# EAGLE design CVMot2RaspiBot (EAGLE 9.6.2)
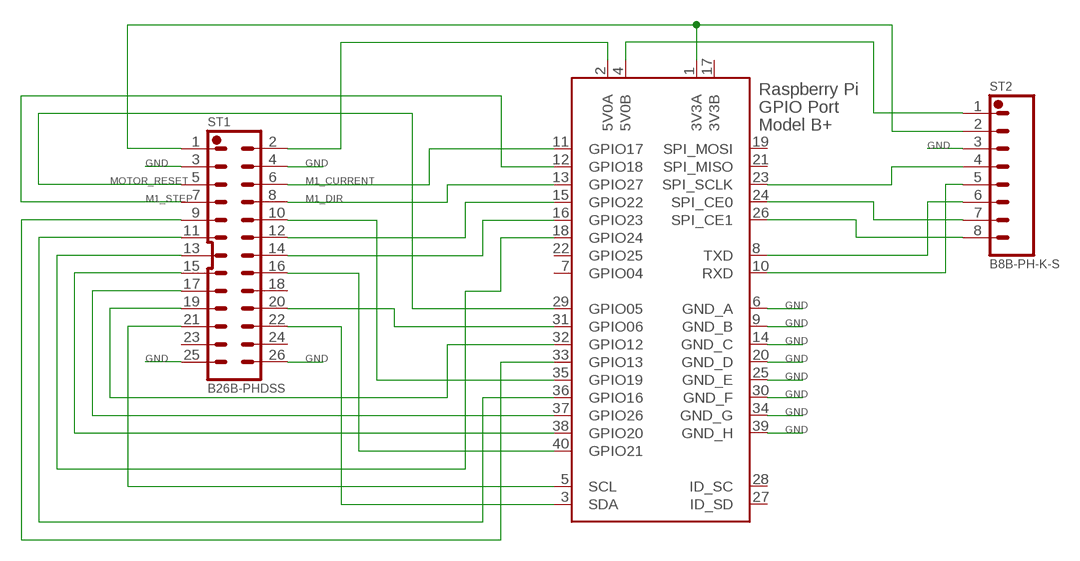
[diagram p0: schematic, sheet 1]

## Parts
ST1  B26B-PHDSS  STK-26-2RJST-PHD_26_TH  [JST-PHD_26_TH]
ST2  B8B-PH-K-S  STK-08-1RJST-PH_8_TH  [JST-PH_8_TH]
X1  RASPI_GPIO_B+#_PIN  [RASPI_GPIO_B+_PIN]

## Nets
GND: ST1.3 ST1.4 ST1.25 ST1.26 ST2.3 X1.6(GND_A) X1.9(GND_B) X1.14(GND_C) X1.20(GND_D) X1.25(GND_E) X1.30(GND_F) X1.34(GND_G) X1.39(GND_H)
M1_CURRENT: ST1.6 X1.11(GPIO17)
M1_DIR: ST1.8 X1.13(GPIO27)
M1_STEP: ST1.7 X1.12(GPIO18)
MOTOR_RESET: ST1.5 X1.29(GPIO05)
N$1: ST1.9 X1.33(GPIO13)
N$2: ST1.11 X1.36(GPIO16)
N$3: ST1.10 X1.35(GPIO19)
N$4: ST1.12 X1.15(GPIO22)
N$5: ST1.14 X1.16(GPIO23)
N$6: ST1.13 X1.18(GPIO24)
N$7: ST1.15 X1.38(GPIO20)
N$8: ST1.17 X1.37(GPIO26)
N$9: ST1.16 X1.40(GPIO21)
N$10: ST1.19 X1.32(GPIO12)
N$11: ST1.20 X1.31(GPIO06)
N$19: ST2.4 X1.23(SPI_SCLK)
N$20: ST1.2 X1.2(5V0A)
N$21: ST1.1 ST2.2 X1.1(3V3A)
N$22: ST1.21 X1.5(SCL)
N$23: ST1.22 X1.3(SDA)
N$24: ST2.1 X1.4(5V0B)
N$27: ST2.5 X1.10(RXD)
N$28: ST2.6 X1.8(TXD)
N$29: ST2.7 X1.24(SPI_CE0)
N$30: ST2.8 X1.26(SPI_CE1)
Unconnected: ST1.18 ST1.23 ST1.24 X1.7(GPIO04) X1.19(SPI_MOSI) X1.21(SPI_MISO) X1.22(GPIO25) X1.27(ID_SD) X1.28(ID_SC)

## Power pins joined to a net without a drawn wire
3V3B: X1.17(3V3B)

## Library data of the parts
ST1 = CV_Con:STK-26-2R
ST2 = CV_Con:STK-08-1R
X1 = raspberrypi_bastelstube_v13:RASPI_GPIO_B+#: 2x20 header connector, all pins connected

## Board
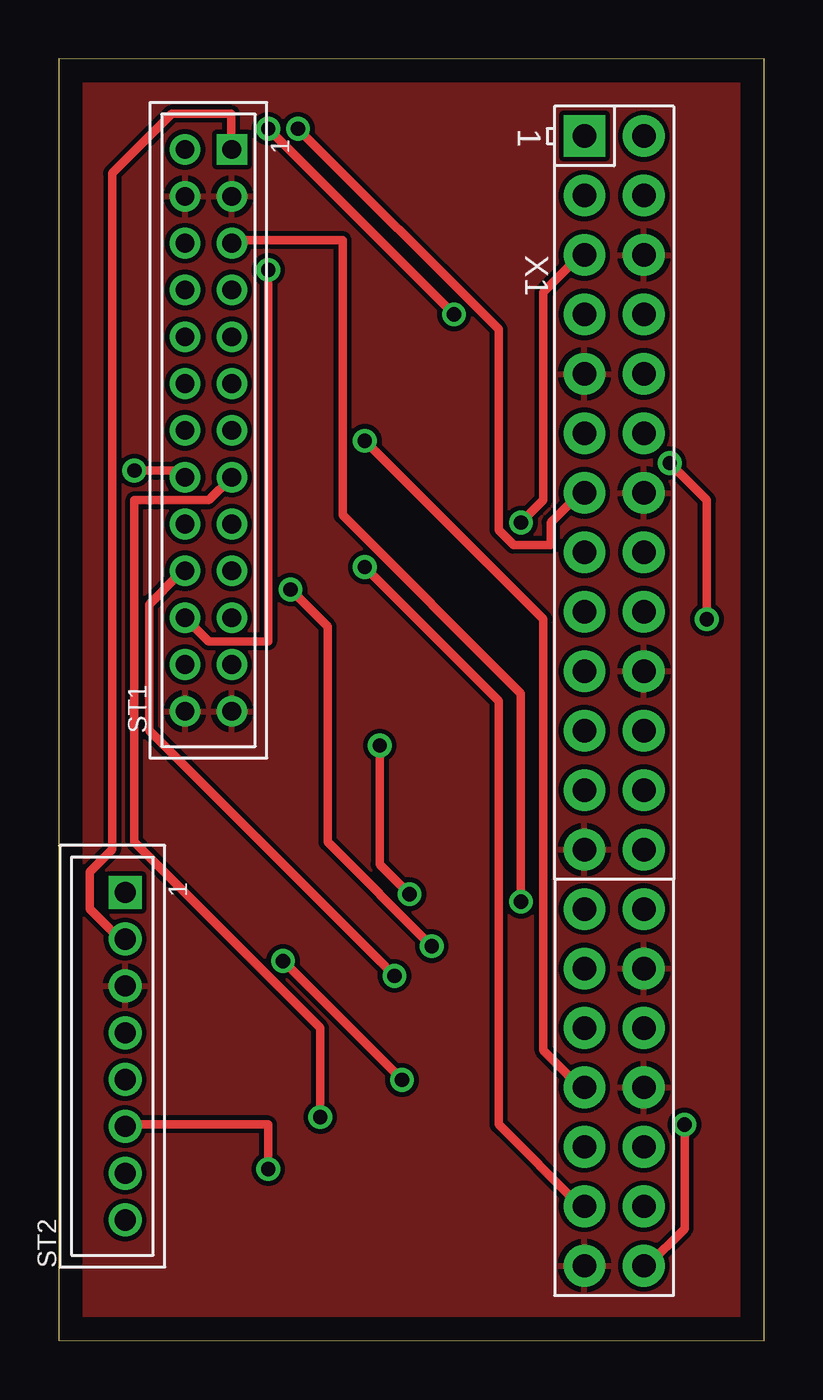
[diagram p1: board, top side]
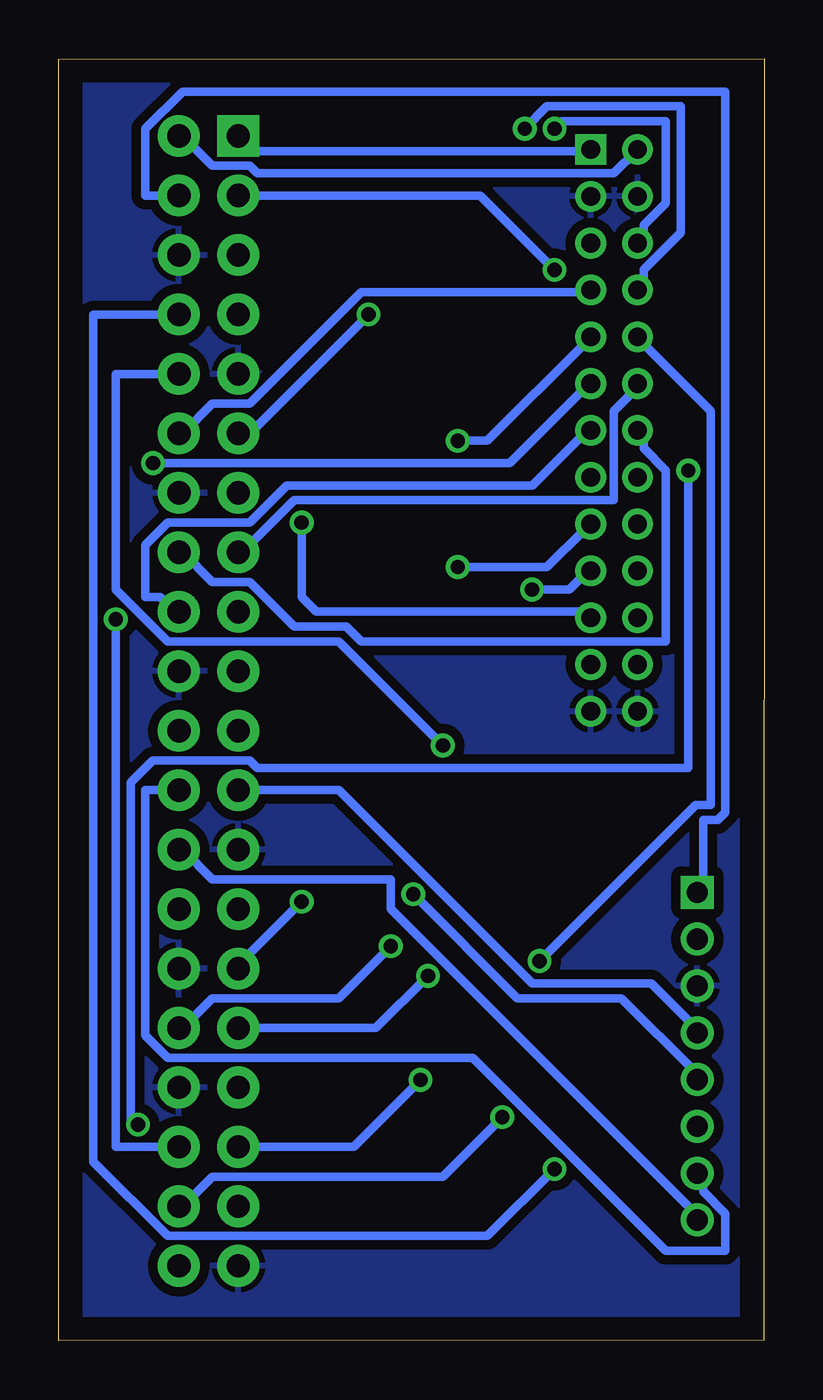
[diagram p2: board, bottom side, seen from below]

Size 30.13 x 54.79 mm. Coordinates in mm from the lower left corner, seen from the top.
Outline: 0.01,0.03 30.13,0 30.13,54.76 0,54.79 0.01,0.03
Copper layers (1*16): Top 0.035mm / dielectric 1.5mm / Bottom 0.035mm
Design rules "default *": minimum track width 14mil, minimum drill 24mil, track to track 8mil, track to pad 5mil, pad to pad 8mil, via to via 8mil, smd to smd 8mil, copper to edge 40mil, drill to drill 8mil, minimum pad ring 10mil, minimum via ring 8mil, stop-mask expansion 4mil, vias tented up to drill 0mil, thermal gap 10mil

### Footprints (pad centres in the part's own frame; a part is rotated, then mirrored left to right if it is on the bottom)
JST-PHD_26_TH = drill 0.8 square: 1 12,-1 | drill 0.8: 2 12,1; 3 10,-1; 4 10,1; 5 8,-1; 6 8,1; 7 6,-1; 8 6,1; 9 4,-1; 10 4,1; 11 2,-1; 12 2,1; 13 0,-1; 14 0,1; 15 -2,-1; 16 -2,1; 17 -4,-1; 18 -4,1; 19 -6,-1; 20 -6,1; 21 -8,-1; 22 -8,1; 23 -10,-1; 24 -10,1; 25 -12,-1; 26 -12,1
JST-PH_8_TH = drill 0.9 square: 1 7,0 | drill 0.9: 2 5,0; 3 3,0; 4 1,0; 5 -1,0; 6 -3,0; 7 -5,0; 8 -7,0
RASPI_GPIO_B+_PIN = drill 1 pad 1.778 square: 1 -24.13,-1.27 | drill 1 pad 1.778: 2 -24.13,1.27; 3 -21.59,-1.27; 4 -21.59,1.27; 5 -19.05,-1.27; 6 -19.05,1.27; 7 -16.51,-1.27; 8 -16.51,1.27; 9 -13.97,-1.27; 10 -13.97,1.27; 11 -11.43,-1.27; 12 -11.43,1.27; 13 -8.89,-1.27; 14 -8.89,1.27; 15 -6.35,-1.27; 16 -6.35,1.27; 17 -3.81,-1.27; 18 -3.81,1.27; 19 -1.27,-1.27; 20 -1.27,1.27; 21 1.27,-1.27; 22 1.27,1.27; 23 3.81,-1.27; 24 3.81,1.27; 25 6.35,-1.27; 26 6.35,1.27; 27 8.89,-1.27; 28 8.89,1.27; 29 11.43,-1.27; 30 11.43,1.27; 31 13.97,-1.27; 32 13.97,1.27; 33 16.51,-1.27; 34 16.51,1.27; 35 19.05,-1.27; 36 19.05,1.27; 37 21.59,-1.27; 38 21.59,1.27; 39 24.13,-1.27; 40 24.13,1.27

### Placement (x,y rotation side)
ST1  6.4,38.9 90 top
ST2  2.84,12.17 90 top
X1  23.72,27.34 270 top

### Tracks (layer width: path | path; a pad name or v marks a point on that pad's centre or on a via)
GND
  pour Top: -0.05,54.74 30.05,54.74 30.23,54.56 30.23,0.04 30.18,-0.01 -0.05,-0.01 0.01,0.05 0.01,54.64 0.06,54.69
  pour Bottom (isolate 0.406): 0.01,54.74 30.06,54.74 30.11,54.69 30.11,0.05 30.05,-0.01 0.25,-0.01 0.01,-0.25 0.01,54.64 0.06,54.69
M1_CURRENT  (via drill 0.61)
  Top 0.356: v16.89,43.85 v8.95,51.79
  Bottom 0.356: v8.95,51.79 8.64,52.11 4.19,52.11 4.19,48.62 5.14,47.66 5.14,47.03 ST1.6 | v16.89,43.85 21.97,38.77 X1.11
M1_DIR  (via drill 0.61)
  Top 0.356: v10.22,51.79 18.8,43.22 18.8,34.65 19.43,34.01 21.02,34.01 21.02,34.96 22.29,36.23 X1.13
  Bottom 0.356: v10.22,51.79 9.27,52.74 3.56,52.74 3.56,47.35 5.14,45.76 5.14,45.12 ST1.8
M1_STEP
  Bottom 0.356: ST1.7 7.68,44.81 17.21,44.81 21.97,40.04 23.56,40.04 24.83,38.77 X1.12
MOTOR_RESET  (via drill 0.61)
  Top 0.356: v19.75,18.77 19.75,27.66 12.13,35.28 12.13,47.03 7.68,47.03 ST1.5
  Bottom 0.356: v19.75,18.77 22.61,15.91 X1.29
N$1  (via drill 0.61)
  Top 0.356: v13.08,38.46 20.7,30.84 20.7,12.42 22.29,10.83 X1.33
  Bottom 0.356: v13.08,38.46 11.81,38.46 7.68,42.58 ST1.9
N$2  (via drill 0.61)
  Top 0.356: v26.1,37.5 27.69,35.92 v27.69,30.84
  Bottom 0.356: v26.1,37.5 10.86,37.5 7.68,40.68 ST1.11 | v27.69,30.84 27.69,8.29 X1.36
N$3  (via drill 0.61)
  Top 0.356: v14.67,11.15 v9.59,16.23
  Bottom 0.356: v9.59,16.23 2.92,22.9 2.29,22.9 2.29,39.73 5.14,42.58 ST1.10 | v14.67,11.15 17.53,8.29 X1.35
N$4
  Bottom 0.356: ST1.12 5.46,40.68 6.41,39.73 6.41,35.92 20.07,35.92 22.29,33.69 X1.15
N$5
  Bottom 0.356: ST1.14 5.14,38.77 5.14,38.14 4.19,37.19 4.19,29.88 17.21,29.88 17.84,30.52 20.07,30.52 21.97,32.42 23.56,32.42 24.83,33.69 X1.16
N$6
  Bottom 0.356: ST1.13 7.68,38.77 9.91,36.55 20.38,36.55 21.97,34.96 25.46,34.96 26.42,34.01 26.42,31.79 25.78,31.79 25.15,31.15 X1.18
N$7  (via drill 0.61)
  Top 0.356: v11.18,9.56 11.18,13.37 3.24,21.31 3.24,35.92 6.41,35.92 7.37,36.87 ST1.15
  Bottom 0.356: v11.18,9.56 13.72,7.02 23.56,7.02 24.83,5.75 X1.38
N$8  (via drill 0.61)
  Top 0.356: v13.08,33.06 18.8,27.34 18.8,9.25 22.29,5.75 X1.37
  Bottom 0.356: v13.08,33.06 9.27,33.06 7.68,34.65 ST1.17
N$9  (via drill 0.61)
  Top 0.356: v3.24,37.19 5.14,37.19 ST1.16 | v26.73,9.25 26.73,4.8 25.15,3.21 X1.40
  Bottom 0.356: v3.24,37.19 3.24,24.49 21.65,24.49 21.97,24.8 26.1,24.8 27.05,23.85 27.05,9.25 v26.73,9.25
N$10  (via drill 0.61)
  Top 0.356: v9.91,32.11 11.49,30.52 11.49,21.31 v15.94,16.87
  Bottom 0.356: v9.91,32.11 8.32,32.11 7.68,32.74 ST1.19 | v15.94,16.87 18.16,14.64 23.56,14.64 24.83,13.37 X1.32
N$11  (via drill 0.61)
  Top 0.356: v14.35,15.6 3.87,26.07 3.87,31.47 5.14,32.74 ST1.20
  Bottom 0.356: v14.35,15.6 16.57,13.37 X1.31
N$19
  Bottom 0.356: X1.23 18.16,23.53 9.91,15.28 4.83,15.28 2.92,13.37 ST2.4
N$20
  Bottom 0.356: ST1.2 5.46,50.84 6.41,49.89 21.65,49.89 21.97,50.2 23.56,50.2 24.83,51.47 X1.2
N$21
  Top 0.356: ST2.2 2.6,17.18 1.33,18.45 1.33,20.04 2.29,20.99 2.29,49.89 4.83,52.43 7.37,52.43 7.37,51.16 ST1.1
  Bottom 0.356: ST1.1 7.68,50.84 21.65,50.84 22.29,51.47 X1.1
N$22  (via drill 0.61)
  Top 0.356: v19.75,34.96 20.7,35.92 20.7,44.81 22.29,46.39 X1.5
  Bottom 0.356: v19.75,34.96 19.75,31.79 19.11,31.15 7.68,31.15 ST1.21
N$23  (via drill 0.61)
  Top 0.356: v8.95,45.76 8.95,29.88 6.41,29.88 5.46,30.84 ST1.22
  Bottom 0.356: v8.95,45.76 12.13,48.93 X1.3
N$24
  Bottom 0.356: X1.4 26.42,48.93 26.42,51.79 24.83,53.38 1.65,53.38 1.65,22.58 1.97,22.26 2.6,22.26 2.6,19.41 ST2.1
N$27  (via drill 0.61)
  Top 0.356: v14.99,19.09 13.72,20.36 v13.72,25.44
  Bottom 0.356: v14.99,19.09 10.54,14.64 6.1,14.64 2.92,11.47 ST2.5 | v13.72,25.44 18.16,29.88 25.46,29.88 27.69,32.11 27.69,41.31 X1.10
N$28  (via drill 0.61)
  Top 0.356: v8.95,7.34 8.95,9.25 2.92,9.25 ST2.6
  Bottom 0.356: v8.95,7.34 11.81,4.48 25.46,4.48 28.64,7.66 28.64,43.85 X1.8
N$29
  Bottom 0.356: X1.24 26.42,23.53 26.42,13.06 25.46,12.1 12.45,12.1 4.19,3.85 1.65,3.85 1.65,5.44 2.6,6.39 2.6,7.02 ST2.7
N$30
  Bottom 0.356: ST2.8 2.92,5.44 15.94,18.45 15.94,19.72 23.56,19.72 24.83,20.99 X1.26